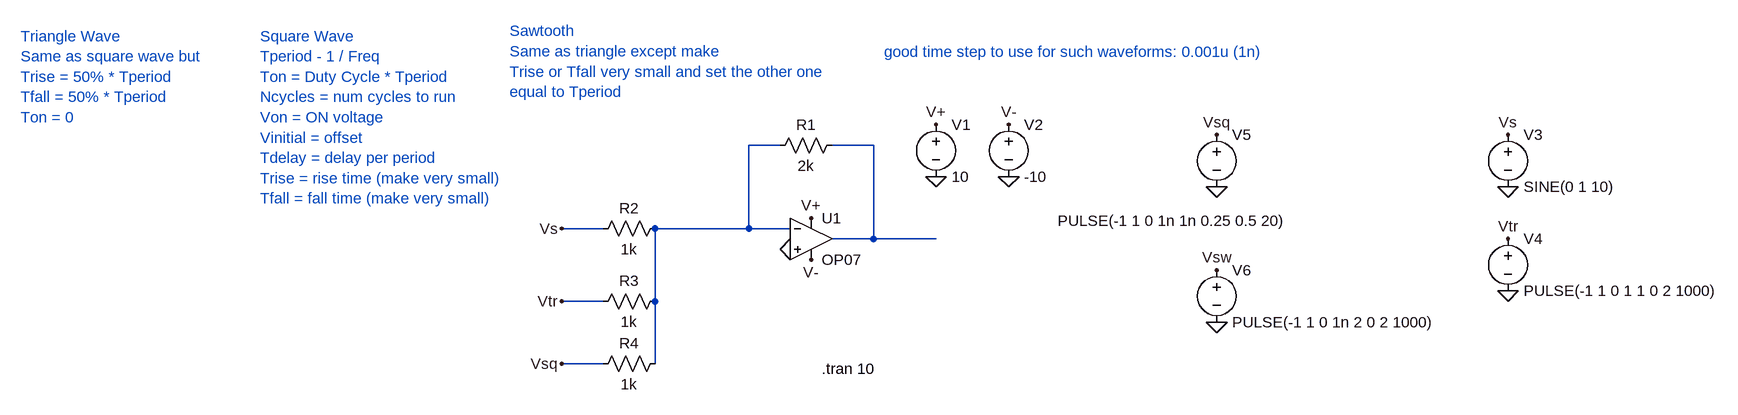
[diagram p0: schematic LTSPICE_Lesson7_ACWaves.asc]
LTSPICE_Lesson7_ACWaves.asc, the LTspice schematic file:
Version 4
SHEET 1 1736 680
WIRE 272 -32 224 -32
WIRE 416 -32 352 -32
WIRE 0 96 -64 96
WIRE 224 96 224 -32
WIRE 224 96 80 96
WIRE 288 96 224 96
WIRE 416 112 416 -32
WIRE 416 112 352 112
WIRE 512 112 416 112
WIRE 0 208 -64 208
WIRE 80 208 80 96
WIRE 0 304 -64 304
WIRE 80 304 80 208
FLAG 288 128 0
FLAG 624 16 0
FLAG 512 16 0
FLAG 512 -64 V+
FLAG 320 80 V+
FLAG 320 144 V-
FLAG 624 -64 V-
FLAG 1392 32 0
FLAG 1392 192 0
FLAG 944 32 0
FLAG 1392 -48 Vs
FLAG 1392 112 Vtr
FLAG -64 96 Vs
FLAG -64 208 Vtr
FLAG 944 -48 Vsq
FLAG -64 304 Vsq
FLAG 944 240 0
FLAG 944 160 Vsw
SYMBOL OpAmps\\OP07 320 48 R0
SYMATTR InstName U1
SYMBOL res 368 -48 R90
WINDOW 0 0 56 VBottom 2
WINDOW 3 32 56 VTop 2
SYMATTR InstName R1
SYMATTR Value 2k
SYMBOL res 96 80 R90
WINDOW 0 0 56 VBottom 2
WINDOW 3 32 56 VTop 2
SYMATTR InstName R2
SYMATTR Value 1k
SYMBOL res 96 192 R90
WINDOW 0 0 56 VBottom 2
WINDOW 3 32 56 VTop 2
SYMATTR InstName R3
SYMATTR Value 1k
SYMBOL res 96 288 R90
WINDOW 0 0 56 VBottom 2
WINDOW 3 32 56 VTop 2
SYMATTR InstName R4
SYMATTR Value 1k
SYMBOL voltage 512 -80 R0
WINDOW 123 0 0 Left 0
WINDOW 39 0 0 Left 0
SYMATTR InstName V1
SYMATTR Value 10
SYMBOL voltage 624 -80 R0
WINDOW 123 0 0 Left 0
WINDOW 39 0 0 Left 0
SYMATTR InstName V2
SYMATTR Value -10
SYMBOL voltage 1392 -64 R0
WINDOW 123 0 0 Left 0
WINDOW 39 0 0 Left 0
SYMATTR InstName V3
SYMATTR Value SINE(0 1 10)
SYMBOL voltage 1392 96 R0
WINDOW 123 0 0 Left 0
WINDOW 39 0 0 Left 0
SYMATTR InstName V4
SYMATTR Value PULSE(-1 1 0 1 1 0 2 1000)
SYMBOL voltage 944 -64 R0
WINDOW 3 -245 148 Left 2
WINDOW 123 0 0 Left 0
WINDOW 39 0 0 Left 0
SYMATTR Value PULSE(-1 1 0 1n 1n 0.25 0.5 20)
SYMATTR InstName V5
SYMBOL voltage 944 144 R0
WINDOW 123 0 0 Left 0
WINDOW 39 0 0 Left 0
SYMATTR InstName V6
SYMATTR Value PULSE(-1 1 0 1n 2 0 2 1000)
TEXT -528 -200 Left 2 ;Square Wave\nTperiod - 1 / Freq\nTon = Duty Cycle * Tperiod\nNcycles = num cycles to run \nVon = ON voltage\nVinitial = offset\nTdelay = delay per period\nTrise = rise time (make very small)\nTfall = fall time (make very small)
TEXT -896 -200 Left 2 ;Triangle Wave \nSame as square wave but \nTrise = 50% * Tperiod \nTfall = 50% * Tperiod\nTon = 0
TEXT -144 -208 Left 2 ;Sawtooth \nSame as triangle except make\nTrise or Tfall very small and set the other one \nequal to Tperiod
TEXT 432 -176 Left 2 ;good time step to use for such waveforms: 0.001u (1n)
TEXT 336 312 Left 2 !.tran 10

The netlist it stands for:
* LTSPICE_Lesson7_ACWaves.asc
XU1 0 N001 V+ V- N002 LT1001  ; OP07, pins In+ In- V+ V- OUT
R1 N002 N001 2k
R2 N001 Vs 1k
R3 N001 Vtr 1k
R4 N001 Vsq 1k
V1 V+ 0 10
V2 V- 0 -10
V3 Vs 0 SINE(0 1 10)
V4 Vtr 0 PULSE(-1 1 0 1 1 0 2 1000)
V5 Vsq 0 PULSE(-1 1 0 1n 1n 0.25 0.5 20)
V6 Vsw 0 PULSE(-1 1 0 1n 2 0 2 1000)
* Square Wave
* Tperiod - 1 / Freq
* Ton = Duty Cycle * Tperiod
* Ncycles = num cycles to run
* Von = ON voltage
* Vinitial = offset
* Tdelay = delay per period
* Trise = rise time (make very small)
* Tfall = fall time (make very small)
* Triangle Wave
* Same as square wave but
* Trise = 50% * Tperiod
* Tfall = 50% * Tperiod
* Ton = 0
* Sawtooth
* Same as triangle except make
* Trise or Tfall very small and set the other one
* equal to Tperiod
* good time step to use for such waveforms: 0.001u (1n)
.tran 10
.lib LTC.lib
.backanno
.end